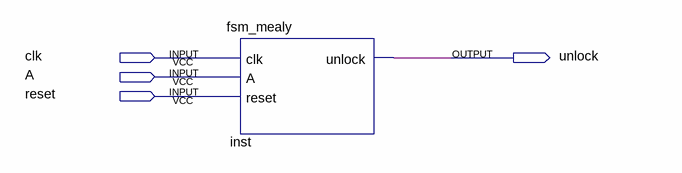
[diagram p0: schematic sheet]
// Quartus schematic fsm_mealy_top.bdf as structural Verilog: 1 symbols, 4 pins
module fsm_mealy_top (
  input  clk,
  input  A,
  input  reset,
  output unlock
);

  fsm_mealy inst (.clk(clk), .A(A), .reset(reset), .unlock(unlock));
endmodule
